# EAGLE design TinyMicroGameboy (EAGLE 6.5.0)
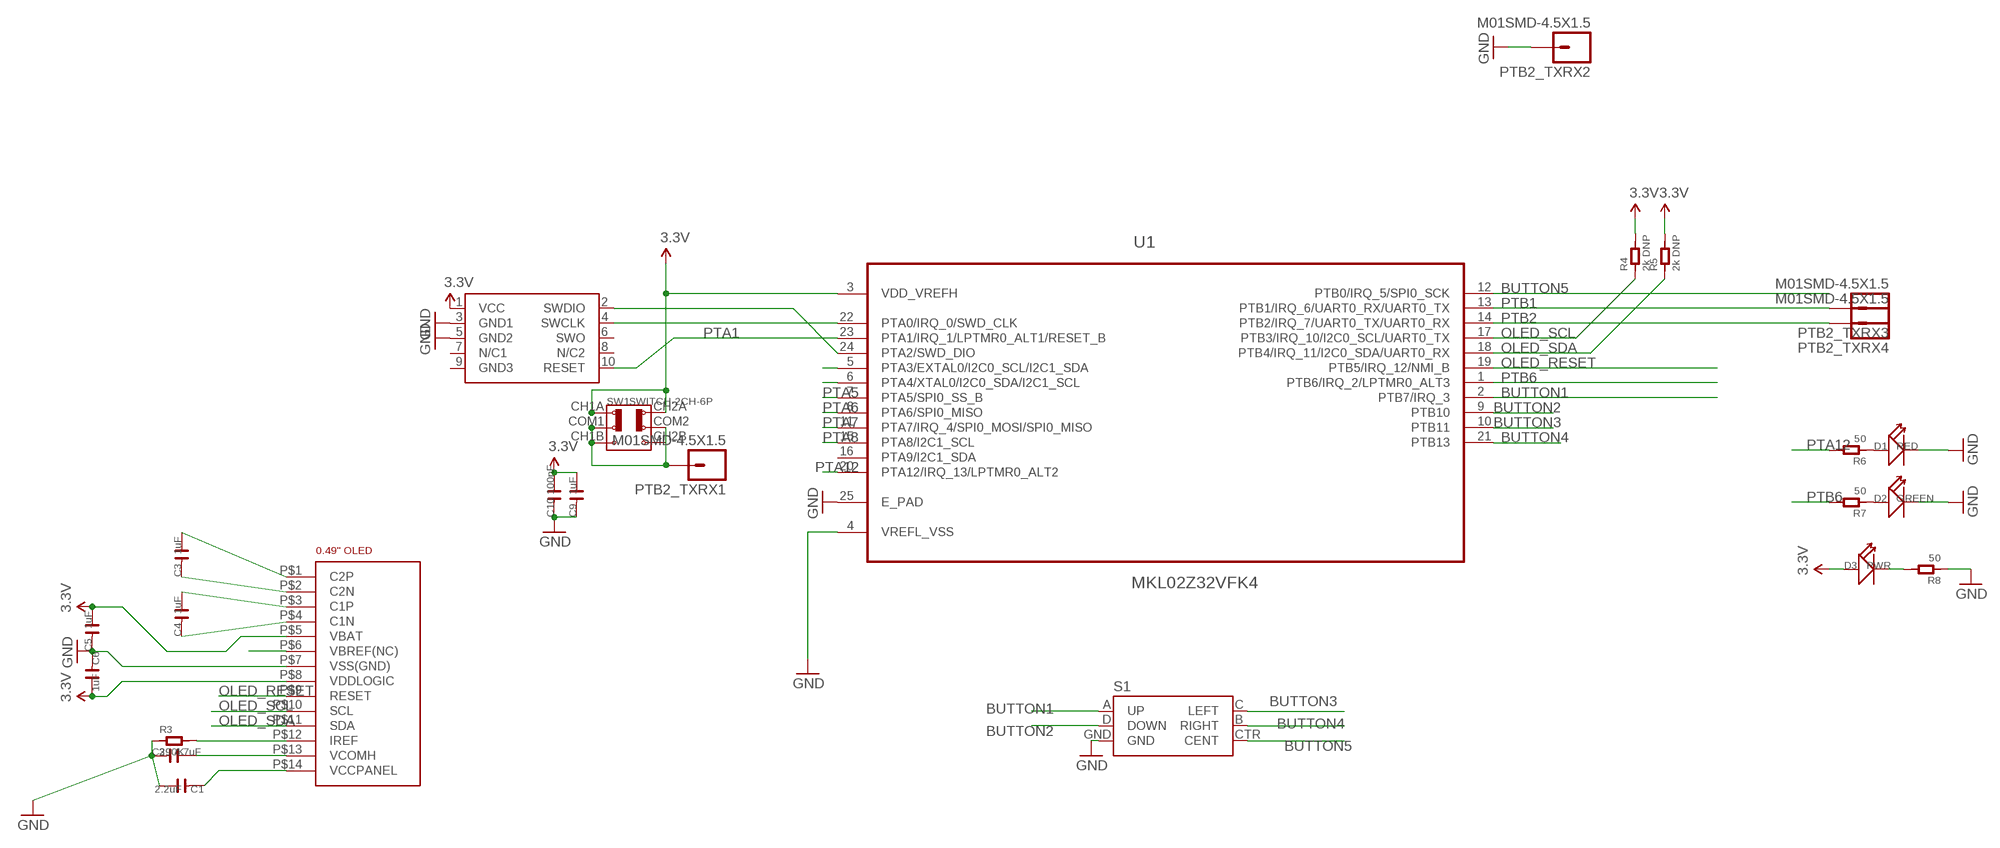
[diagram p0: schematic, sheet 1]

## Parts
C1  2.2uF  C-0603  [C0603]
C2  4.7uF  C-0603  [C0603]
C3  1uF  C-0603  [C0603]
C4  1uF  C-0603  [C0603]
C5  1uF  C-0603  [C0603]
C6  1uF  C-0603  [C0603]
C9  1uF  C-0603  [C0603]
C10  100nF  C-0603  [C0603]
D1  RED  LED  [LED0603]
D2  GREEN  LED  [LED0603]
D3  PWR  LED  [LED0603]
PTB2_TXRX1  M01SMD-4.5X1.5  [PAD-1.5X4.5]
PTB2_TXRX2  M01SMD-4.5X1.5  [PAD-1.5X4.5]
PTB2_TXRX3  M01SMD-4.5X1.5  [PAD-1.5X4.5]
PTB2_TXRX4  M01SMD-4.5X1.5  [PAD-1.5X4.5]
R3  390K  R-0603  [R0603]
R4  2k DNP  R-0603  [R0603]
R5  2k DNP  R-0603  [R0603]
R6  50  R-0603  [R0603]
R7  50  R-0603  [R0603]
R8  50  R-0603  [R0603]
S1  JOYSTICK_MINI  [JOYSTICK_MINI]
SW1  SWITCH-2CH-6P  [6P-2CH-SIDEMOUNT]
SWD1  CORTEX_SWD  [M50-3600542]
U1  MKL02Z32VFK4  [QFN50P400X400X100-25N]
U$1  0.49"OLEDFOLDED  [0.49"-FPC-0.7-14-FOLDED]

## Nets
3.3V: C5.2 C6.2 C9.2 C10.2 D3.+ R4.2 R5.2 SW1.CH1A SW1.CH2A SWD1.1(VCC) U1.3(VDD_VREFH) U$1.P$5(VBAT) U$1.P$8(VDDLOGIC)
BUTTON1: S1.A(UP) U1.2(PTB7/IRQ_3)
BUTTON2: S1.D(DOWN) U1.9(PTB10)
BUTTON3: S1.C(LEFT) U1.10(PTB11)
BUTTON4: S1.B(RIGHT) U1.21(PTB13)
BUTTON5: S1.CTR(CENT) U1.12(PTB0/IRQ_5/SPI0_SCK)
GND: C1.2 C2.1 C5.1 C6.1 C9.1 C10.1 D1.- D2.- PTB2_TXRX2.P$1 R3.1 R8.1 S1.GND SWD1.3(GND1) SWD1.5(GND2) U1.4(VREFL_VSS) U1.25(E_PAD) U$1.P$7(VSS(GND))
N$1: U1.5(PTA3/EXTAL0/I2C0_SCL/I2C1_SDA)
N$2: U1.6(PTA4/XTAL0/I2C0_SDA/I2C1_SCL)
N$3: C3.2 U$1.P$1(C2P)
N$4: C4.2 U$1.P$3(C1P)
N$5: SWD1.4(SWCLK) U1.22(PTA0/IRQ_0/SWD_CLK)
N$6: D1.+ R6.1
N$7: SWD1.2(SWDIO) U1.24(PTA2/SWD_DIO)
N$8: U$1.P$6(VBREF(NC))
N$9: R3.2 U$1.P$12(IREF)
N$10: C1.1 U$1.P$14(VCCPANEL)
N$11: C2.2 U$1.P$13(VCOMH)
N$12: C3.1 U$1.P$2(C2N)
N$13: C4.1 U$1.P$4(C1N)
N$14: D2.+ R7.1
N$19: D3.- R8.2
N$20: PTB2_TXRX1.P$1 SW1.CH1B SW1.CH2B SW1.COM1 SW1.COM2
OLED_RESET: U1.19(PTB5/IRQ_12/NMI_B) U$1.P$9(RESET)
OLED_SCL: R4.1 U1.17(PTB3/IRQ_10/I2C0_SCL/UART0_TX) U$1.P$10(SCL)
OLED_SDA: R5.1 U1.18(PTB4/IRQ_11/I2C0_SDA/UART0_RX) U$1.P$11(SDA)
PTA1: SWD1.10(RESET) U1.23(PTA1/IRQ_1/LPTMR0_ALT1/RESET_B)
PTA5: U1.7(PTA5/SPI0_SS_B)
PTA6: U1.8(PTA6/SPI0_MISO)
PTA7: U1.11(PTA7/IRQ_4/SPI0_MOSI/SPI0_MISO)
PTA8: U1.15(PTA8/I2C1_SCL)
PTA12: R6.2 U1.20(PTA12/IRQ_13/LPTMR0_ALT2)
PTB1: PTB2_TXRX3.P$1 U1.13(PTB1/IRQ_6/UART0_RX/UART0_TX)
PTB2: PTB2_TXRX4.P$1 U1.14(PTB2/IRQ_7/UART0_TX/UART0_RX)
PTB6: R7.2 U1.1(PTB6/IRQ_2/LPTMR0_ALT3)
Unconnected: SWD1.6(SWO) SWD1.7(N/C1) SWD1.8(N/C2) SWD1.9(GND3) U1.16(PTA9/I2C1_SDA)

## Library data of the parts
C1-C6 C9 C10 = OPL:C*
D1-D3 = OPL:LED*: LED
PTB2_TXRX1-PTB2_TXRX4 = SparkFun-Connectors:M01: Header 1 Standard 1-pin 0.1" header. Use with straight break away headers (SKU : PRT-00116), right angle break away headers (PRT-00553), swiss pins (PRT-00743), machine pins (PRT-00117), and female headers (PRT-00115).
R3-R8 = OPL:R*
S1 = SparkFun-Electromechanical:JOYSTICK_MINI: Small 5-way tactile joystick, COM-10063 4UCON SF303GJ26
SW1 = zephod-components:SWITCH-2CH-6P*: MS-22D18 G2 ROHS
SWD1 = carrilib with jtags:CORTEX_SWD: .05" Cortex M Connector in SWD mode Manufacturer: Generic Part Number: Cortex M SWD Notes: I use Harwin M50-3600542 connectors
U1 = FarnellThings:MKL02Z32VFK4: IC, MCU, 32BIT, CORTEX M0+, 48MHZ, QFN-24; MPN: MKL02Z32VFK4; OC_FARNELL: 2321481; OC_NEWARK: 61W9887; PACKAGE: QFN-24; SUPPLIER: FREESCALE SEMICONDUCTOR
U$1 = zephod-tft:0.49"OLED

## Board
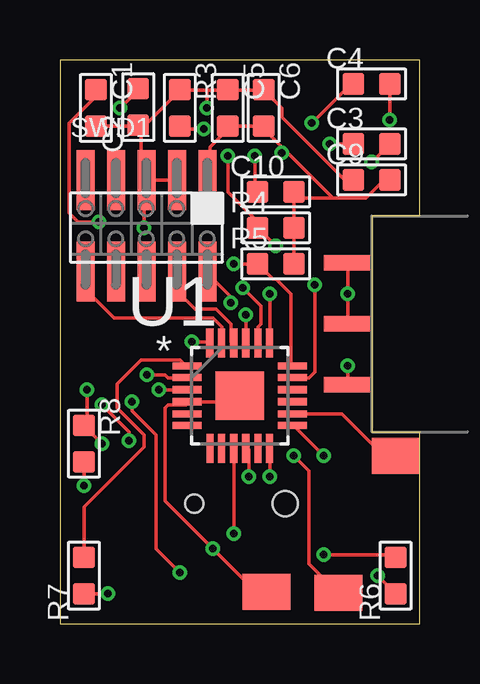
[diagram p1: board, top side]
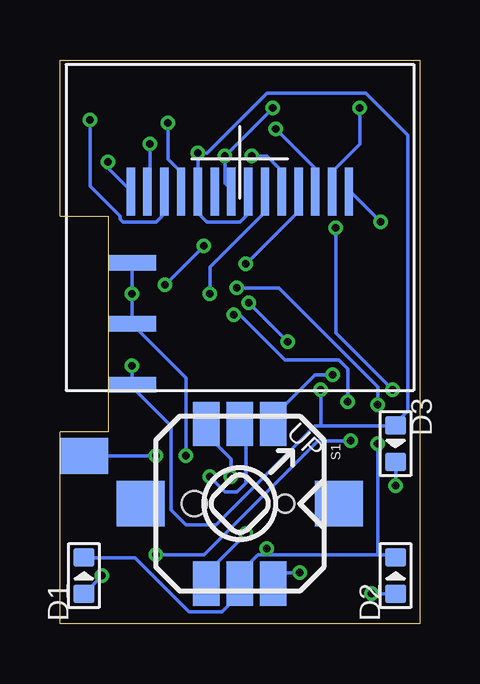
[diagram p2: board, bottom side, seen from below]

Size 15 x 23.5 mm. Coordinates in mm from the lower left corner, seen from the top.
Outline: 0,0 15,0 15,8 13,8 13,17 15,17 15,23.5 0,23.5 0,0
Copper layers (1*16): Top 0.035mm / dielectric 1.5mm / Bottom 0.035mm
Design rules "ITEADstudio_DRC": minimum track width 6mil, minimum drill 12mil, track to track 6mil, track to pad 6mil, pad to pad 6mil, via to via 6mil, smd to smd 0mil, copper to edge 10mil, drill to drill 10mil, minimum pad ring 10mil, minimum via ring 6mil, stop-mask expansion 2mil, vias tented up to drill 100mil, thermal gap 10mil

### Footprints (pad centres in the part's own frame; a part is rotated, then mirrored left to right if it is on the bottom)
C0603 = smd 0.889 x 0.889: 1 -0.762,0; 2 0.762,0
LED0603 = smd 0.762 x 0.889: + -0.762,0; - 0.762,0
PAD-1.5X4.5 = smd 1.5 x 2: P$1 0,0
R0603 = smd 0.889 x 0.889: 1 -0.762,0; 2 0.762,0
JOYSTICK_MINI = smd 1.85 x 1.1: A -3.325,1.4; B 3.325,1.4; C -3.325,-1.4; CTR -3.325,0; D 3.325,-1.4; GND 3.325,0 | smd 1.9 x 2: NC 0,4.13; NC@0 0,-4.13 | hole 0.75: 0,1.9 | hole 1.05: 0,-1.9
6P-2CH-SIDEMOUNT = smd 0.635 x 2: CH1A -2.54,1; CH1B 2.54,1; COM1 0,1 | smd 0.635 x 2 bottom: CH2A -2.54,1; CH2B 2.54,1; COM2 0,1
M50-3600542 = smd 0.75 x 2.5: 1 -2.54,-1.81; 2 -2.54,2; 3 -1.27,-1.81; 4 -1.27,2; 5 0,-1.81; 6 0,2; 7 1.27,-1.81; 8 1.27,2; 9 2.54,-1.81; 10 2.54,2
QFN50P400X400X100-25N = smd 1.2 x 0.3: 1 -2.2,1.245; 2 -2.2,0.762; 3 -2.2,0.254; 4 -2.2,-0.254; 5 -2.2,-0.762; 6 -2.2,-1.245; 13 2.2,-1.245; 14 2.2,-0.762; 15 2.2,-0.254; 16 2.2,0.254; 17 2.2,0.762; 18 2.2,1.245 | smd 0.3 x 1.2: 7 -1.245,-2.2; 8 -0.762,-2.2; 9 -0.254,-2.2; 10 0.254,-2.2; 11 0.762,-2.2; 12 1.245,-2.2; 19 1.245,2.2; 20 0.762,2.2; 21 0.254,2.2; 22 -0.254,2.2 | smd 0.305 x 1.2: 23 -0.762,2.2; 24 -1.245,2.2 | smd 2.032 x 2.032: 25 0,0
0.49"-FPC-0.7-14-FOLDED = smd 0.35 x 2: P$1 -4.55,-1.49; P$2 -3.85,-1.49; P$3 -3.15,-1.49; P$4 -2.45,-1.49; P$5 -1.75,-1.49; P$6 -1.05,-1.49; P$7 -0.35,-1.49; P$8 0.35,-1.49; P$9 1.05,-1.49; P$10 1.75,-1.49; P$11 2.45,-1.49; P$12 3.15,-1.49; P$13 3.85,-1.49; P$14 4.55,-1.49

### Placement (x,y rotation side)
C1  1.5,21.5 270 top
C2  3.27,21.54 90 top
C3  13,20 0 top
C4  13,22.5 0 top
C5  7,21.5 270 top
C6  8.5,21.5 270 top
C9  13,18.5 0 top
C10  9,18 0 top
D1  14,2 90 bottom
D2  1,2 90 bottom
D3  1,7.5 270 bottom
PTB2_TXRX1  11.62,1.29 90 top
PTB2_TXRX2  8.62,1.33 90 top
PTB2_TXRX3  14,7 270 bottom
PTB2_TXRX4  14,7 270 top
R3  5,21.5 270 top
R4  9,16.5 0 top
R5  9,15 0 top
R6  14,2 90 top
R7  1,2 90 top
R8  1,7.5 270 top
S1  7.5,5 270 bottom
SW1  13,12.5 90 top
SWD1  3.61,16.67 180 top
U1  7.5,9.5 0 top
U$1  7.5,19.5 0 bottom

### Tracks (layer width: path | path; a pad name or v marks a point on that pad's centre or on a via)
3.3V  (via drill 0.3)
  Top 0.152: R4.2 R5.2 | R4.2 9.75,17.75 | 9.75,17.75 C10.2 9.75,17.75 | R4.2 | C9.2 13.5,18.5 12.75,17.75 11.38,17.75 | 9.75,17.75 11.38,17.75 | 11.38,17.75 9.38,19.75 | 9.38,19.75 8.5,20.62 C6.2 C5.2 7,20.62 6.25,19.88 6.25,18.5 SWD1.1 | 9.38,19.75 v9.25,19.62 | v4.12,9.75 5.25,9.75 U1.3 | v12,10.75 SW1.CH1A
  Bottom 0.152: U$1.P$8 7.25,18 7.25,17 7.5,16.75 8.88,16.75 9.25,17.12 U$1.P$5 v9.25,19.62 8.88,19.62 6.38,22.12 2.25,22.12 0.5,20.38 0.5,8.88 1,8.38 D3.+ 4.12,8.25 | 4.12,8.25 4.38,8.25 8.5,4.12 9.75,4.12 10.38,4.75 10.38,8.25 12,9.88 SW1.CH1A v12,10.75 | 4.12,8.25 v4.12,9.75
BUTTON1  (via drill 0.3)
  Top 0.152: v3.62,10.38 4.38,10.38 4.5,10.25 5.25,10.25 U1.2
  Bottom 0.152: v3.62,10.38 4.38,10.38 6,8.75 6,8.38 S1.A
BUTTON2  (via drill 0.3)
  Top 0.152: v7.25,3.75 7.25,7.25 U1.9
  Bottom 0.152: v7.25,3.75 8.88,2.12 8.88,1.75 S1.D
BUTTON3  (via drill 0.3)
  Top 0.152: v7.88,6.12 7.88,7.25 U1.10
  Bottom 0.152: v7.88,6.12 7.88,6.88 8.88,7.88 8.88,8.25 S1.C
BUTTON4  (via drill 0.3)
  Top 0.152: v7.75,12.88 7.75,11.75 U1.21 | v3,9.25 3,8.88 4,7.88 4,3.12 v5,2.12
  Bottom 0.152: v7.75,12.88 7.5,12.88 5.62,11 3.38,11 3,10.62 v3,9.25 | v5,2.12 5.62,2.12 6,1.75 S1.B
BUTTON5  (via drill 0.3)
  Top 0.152: v8.75,6.12 8.75,7.25 U1.12
  Bottom 0.152: v8.75,6.12 8.12,5.5 7.62,5.5 7.25,5.88 7.25,8 7.5,8.25 S1.CTR
GND  (via drill 0.3)
  Top 0.152: C1.2 3.25,20.75 C2.1 | C2.1 3.38,20.75 3.38,18.62 3.5,18.5 SWD1.5 | SWD1.3 4.88,18.5 3.62,18.5 SWD1.5 | v8.12,19.5 8.12,18 C10.1 | C5.1 6.12,22.25 | 6.12,22.25 R3.1 | C5.1 C6.1 | C5.1 | C9.1 11.88,18.5 9.25,21.12 9.25,21.5 C6.1 | C6.1 | 6.12,22.25 v6.12,21.5 | R3.1 3.62,20.88 3.38,20.88 C2.1 | R3.1 | U1.25 7.25,9.25 5.38,9.25 U1.4 5.25,9.12 4.5,9.12 4.38,9 4.38,5.12 v6.38,3.12 8.12,1.38 8.5,1.38 PTB2_TXRX2.P$1 | v1.75,7.5 1.12,8.12 | 1.12,8.12 R8.1 1.12,8.12 | v3.5,16.5 3.5,18.38 SWD1.5 | 1.12,8.12 v1.12,9.75
  Bottom 0.152: U$1.P$7 7.88,18.12 8.12,18.38 v8.12,19.5 v6.12,21.5 | 6.38,2.88 6.75,2.88 7.5,2.12 S1.GND 7.5,1.25 8.25,0.5 9.62,0.5 11.88,2.75 D1.- | 6.38,2.88 1.75,2.88 | 1.75,2.88 1,2.88 D2.- | 1.75,2.88 v1.75,7.5 | 6.38,2.88 v6.38,3.12 | v3.5,16.5 3.5,12.12 v1.12,9.75
N$3  (via drill 0.3)
  Top 0.152: v13,19.25 C3.2
  Bottom 0.152: v13,19.25 13,19 12.12,18.12 U$1.P$1
N$4  (via drill 0.3)
  Top 0.152: v13.75,21 C4.2
  Bottom 0.152: v13.75,21 13.75,18.25 12.5,17 12.5,16.88 12.38,16.75 11,16.75 10.75,17 10.75,18 U$1.P$3
N$5
  Top 0.152: U1.22 7.12,11.75 7.12,12.5 6.5,13.12 5.62,13.12 5,13.75 5,14.62 SWD1.4
N$6  (via drill 0.3)
  Top 0.152: v13.25,2 R6.1
  Bottom 0.152: v13.25,2 R6.1
N$7  (via drill 0.3)
  Top 0.152: v5.5,11.75 6.25,11.75 U1.24 | v7.12,13.38 7.12,13.62 6.12,14.62 SWD1.2
  Bottom 0.152: v7.12,13.38 v5.5,11.75
N$9  (via drill 0.3)
  Top 0.152: v6,20.62 5,20.62 R3.2
  Bottom 0.152: v6,20.62 4.38,19 4.38,18.12 U$1.P$12
N$10  (via drill 0.3)
  Top 0.152: C1.1 1.5,22 0.38,20.88 0.38,17.12 0.75,16.75 v1.62,16.75
  Bottom 0.152: v1.62,16.75 2.88,18 U$1.P$14
N$11  (via drill 0.3)
  Top 0.152: v2.5,21.5 3.25,22.25 C2.2
  Bottom 0.152: v2.5,21.5 2.5,20 3.62,18.88 3.62,18.12 U$1.P$13
N$12  (via drill 0.3)
  Top 0.152: v11.25,20 C3.1
  Bottom 0.152: v11.25,20 11.25,18.12 U$1.P$2
N$13  (via drill 0.3)
  Top 0.152: v10.5,20.88 12.12,22.5 C4.1
  Bottom 0.152: v10.5,20.88 10.5,19.38 10,18.88 10,18.12 U$1.P$4
N$14  (via drill 0.3)
  Top 0.152: v2,1.25 R7.1
  Bottom 0.152: v2,1.25 R7.1
N$19  (via drill 0.3)
  Top 0.152: v1,5.75 R8.2
  Bottom 0.152: R8.2 v1,5.75
N$20  (via drill 0.3)
  Top 0.152: SW1.CH1B v12,13.75 SW1.COM1 | v9.75,7 10.38,6.38 10.38,2.5 11.5,1.38 PTB2_TXRX1.P$1
  Bottom 0.152: v9.75,7 9.75,10.25 SW1.COM1 v12,13.75 SW1.CH1B
OLED_RESET  (via drill 0.3)
  Top 0.152: v8.75,13.75 8.75,11.75 U1.19
  Bottom 0.152: v8.75,13.75 8.75,14.88 6.5,17.12 6.5,18 U$1.P$9
OLED_SCL  (via drill 0.3)
  Top 0.152: v7,19.5 7,18 8.12,16.88 8.12,16.5 R4.1 v9,15.75 | v10.62,14.12 10.62,10.5 10.38,10.25 9.75,10.25 U1.17
  Bottom 0.152: v7,19.5 6.38,19.5 5.75,18.88 U$1.P$10 | v9,15.75 v10.62,14.12
OLED_SDA  (via drill 0.3)
  Top 0.152: U1.18 9.62,10.75 9.62,13.75 9,14.38 8.88,14.38 R5.1 v7.25,15
  Bottom 0.152: v7.25,15 5.12,17.12 5.12,18 U$1.P$11
PTA1
  Top 0.152: U1.23 6.75,11.75 6.75,12.38 6.38,12.75 2.25,12.75 1.12,13.88 1.12,14.62 SWD1.10
PTA12  (via drill 0.3)
  Top 0.152: v11,2.88 14,2.88 R6.2 | v2.88,7.62 2.88,8 v1.75,9.12 | v7.62,14 8.38,13.25 8.38,12.5 8.25,12.38 8.25,11.75 U1.20
  Bottom 0.152: v11,2.88 9,2.88 4.25,7.62 v2.88,7.62 | v1.75,9.12 1.75,9.88 5.88,14 v7.62,14
PTB1  (via drill 0.3)
  Top 0.152: v11,7 9.75,8.25 U1.13
  Bottom 0.152: PTB2_TXRX3.P$1 v11,7
PTB2
  Top 0.152: PTB2_TXRX4.P$1 13.5,7 11.75,8.75 9.75,8.75 U1.14
PTB6
  Top 0.152: R7.2 1,4.88 3.5,7.38 3.5,7.88 2.38,9 2.38,10 3.38,11 5,11 5.25,10.75 U1.1